# Altium schematic sheet Power.SchDoc: Flight Control Board Power Regulation System
size A; Date: Spring 2012; Author: David Greene; CompanyName: Team Sky Lights; DrawnBy: David Greene; Engineer: D'Acunto & Greene; Organization: Team Sky Lights; DocumentNumber: 1; Revision: 1.0; SheetNumber: 1; SheetTotal: 8; PageSetup: Record=PageOptions|CenterHorizontal=True|CenterVertical=True|PrintScale=1.12|XCorrection=1.00|YCorrection=1.00|PrintKind=0|BorderSize=5000000|LeftOffset=0|BottomOffset=0|Orientation=2|PaperLength=1000|PaperWidth=1000|Scale=100|PaperSource=7|PrintQuality=-4|MediaType=1|DitherType=10|PaperKind=Letter|PrintScaleMode=1; DocumentName: Flight Control Board Power Regulation System; ProjectName: The Ad-Flier!
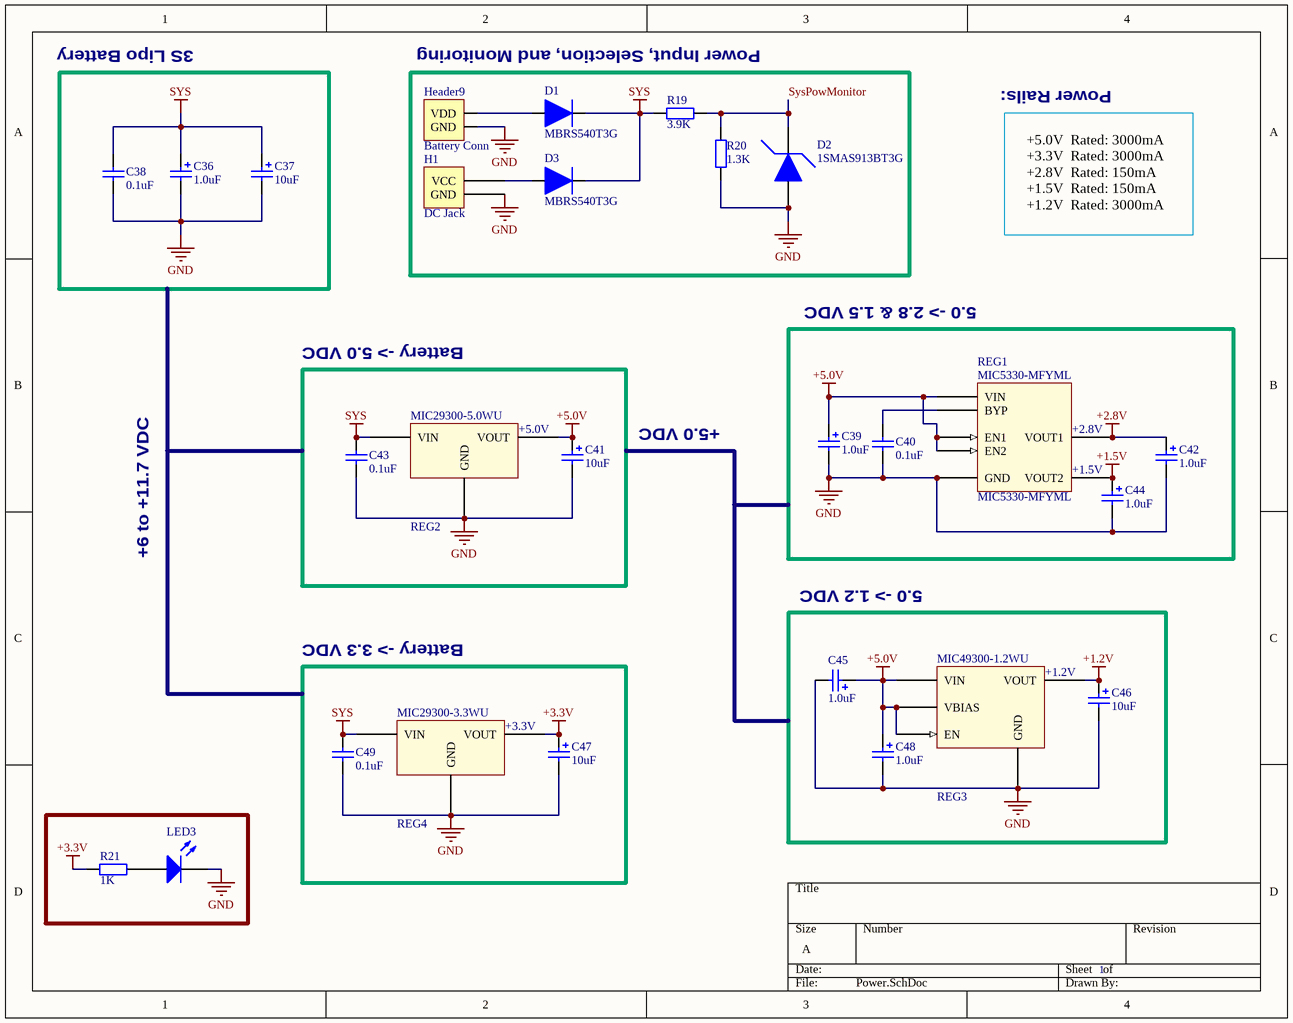
[diagram p0: Power.SchDoc]

## Parts
C36  value 1.0uF  [CAPPR2-5x5]  (hidden comment: 1.0uF Electrolitic)
C37  value 10uF  [CAPPR2-5x5]  (hidden comment: 10uF Electrolitic)
C38  value 0.1uF  [CAPRD5-6.5x4.5]  (hidden comment: 0.1uF Ceramic)
C39  value 1.0uF  [Capacitor - Tantalum Case A]  (hidden comment: 1.0uF Low-ESR Tantalum CaseA)
C40  value 0.1uF  [SMD 1206]  (hidden comment: 0.1uF SMD 1206)
C41  value 10uF  [Capacitor - Tantalum Case A]  (hidden comment: 10uF Low-ESR Tantalum CaseA)
C42  value 1.0uF  [Capacitor - Tantalum Case A]  (hidden comment: 1.0uF Low-ESR Tantalum CaseA)
C43  value 0.1uF  [SMD 1206]  (hidden comment: 0.1uF SMD 1206)
C44  value 1.0uF  [Capacitor - Tantalum Case A]  (hidden comment: 1.0uF Low-ESR Tantalum CaseA)
C45  value 1.0uF  [Capacitor - Tantalum Case A]  (hidden comment: 1.0uF Low-ESR Tantalum CaseA)
C46  value 10uF  [Capacitor - Tantalum Case A]  (hidden comment: 10uF Low-ESR Tantalum CaseA)
C47  value 10uF  [Capacitor - Tantalum Case A]  (hidden comment: 10uF Low-ESR Tantalum CaseA)
C48  value 1.0uF  [Capacitor - Tantalum Case A]  (hidden comment: 1.0uF Low-ESR Tantalum CaseA)
C49  value 0.1uF  [SMD 1206]  (hidden comment: 0.1uF SMD 1206)
D1  MBRS540T3G  [MBRS540T3G]
D2  1SMAS913BT3G  [1SMA5913BT3G]
D3  MBRS540T3G  [MBRS540T3G]
H1  DC Jack  [DC Power Jack]
Header9  Battery Conn  [PC Wire Connector]
LED3  LED PLCC-4  [PLCC-4 LED]  (value not drawn)
R19  value 3.9K  [RES12.2-8.5X3.3]  (hidden comment: 3.9K Radial)
R20  value 1.3K  [RES12.2-8.5X3.3]  (hidden comment: 1.3K Radial)
R21  value 1K  [SMD 0805]  (hidden comment: 1K SMD 0805)
REG1  MIC5330-MFYML  [MIC5330-MFYML TR]
REG2  MIC29300-5.0WU  [TO-263 D2PACK]  (value not drawn)
REG3  MIC49300-1.2WR  [MIC49300-1.2WR SPACK-5]  (value not drawn)
REG4  MIC29300-3.3WU  [TO-263 D2PACK]  (value not drawn)

## Nets
+1.2V: C46.1(+) REG3.4(VOUT)
+1.5V: C44.1(+) REG1.6(VOUT2)
+2.8V: C42.1(+) REG1.7(VOUT1)
+3.3V: C47.1(+) R21.2 REG4.2(VOUT)
+5.0V: C39.1(+) C41.1(+) C45.1(+) C48.1(+) REG1.0(VIN) REG1.3(EN2) REG1.4(EN1) REG2.2(VOUT) REG3.0(EN) REG3.1(VBIAS) REG3.3(VIN)
GND: C36.2 C37.2 C38.1 C39.2(-) C40.1 C41.2(-) C42.2(-) C43.2 C44.2(-) C45.2(-) C46.2(-) C47.2(-) C48.2(-) C49.1 D2.0(In) H1.GND Header9.R(GND) LED3.2(K) R20.1 REG1.1(GND) REG2.1(GND) REG3.2(GND) REG4.1(GND)
SYS: C36.1 C37.1 C38.2 C43.1 C49.2 D1.1(Out) D3.1(Out) R19.2 REG2.0(VIN) REG4.0(VIN)
SysPowMonitor: D2.1(Out) R19.1 R20.2
NetC40_2: C40.2 REG1.2(BYP)
NetD1_0: D1.0(In) Header9.L(VDD)
NetD3_0: D3.0(In) H1.VCC
NetLED3_1: LED3.1(A) R21.1

Not connected (* = marked no-connect by the designer): H1 NC; REG1 5(NC)

## Notes on the sheet
- 3S Lipo Battery
- Power Input, Selection, and Monitoring
- Power Rails:
- +5.0V  Rated: 3000mA
  +3.3V  Rated: 3000mA
  +2.8V  Rated: 150mA
  +1.5V  Rated: 150mA
  +1.2V  Rated: 3000mA
- 5.0 -> 2.8 & 1.5 VDC
- Battery -> 5.0 VDC
- +5.0 VDC
- +6 to +11.7 VDC
- Battery -> 3.3 VDC
- 5.0 -> 1.2 VDC
- 1
- (in symbol MIC5330-MFYML) +2.8V; +1.5V
- (in symbol MIC29300-3.3WU) +3.3V
- (in symbol MIC29300-5.0WU) +5.0V
- (in symbol MIC49300-1.2WR) MIC49300-1.2WU; +1.2V

## Library data of the parts
C36 C37 = Cap Pol1: Polarized Capacitor (Radial); Published: 8-Jun-2000; LatestRevisionDate: 17-Jul-2002; LatestRevisionNote: Re-released for DXP Platform.; PackageReference: RB7.6-15; Publisher: Altium Limited; PackageDescription: Polarized Capacitor (Radial); 2 Leads
C38 C40 C43 C49 = Cap: Capacitor
C39 C41 C42 C44-C48 = SMD_Cap_Tantalum: Tantalum Capacitor - Case A
D1 D3 = MBRS540T3G: 40V 5A Scottky Diode; pin to pad: 0>A 1>K
D2 = 1SMAS913BT3G: 3.3V 1.5W Zener Diode; pin to pad: 0>A 1>K
H1 = DC Jack: DC Power Jack; pin to pad: GND>OUT VCC>IN
Header9 = PC Wire Connector
LED3 = SMD LED: Surface Mount Chip LED; pin to pad: 1>2 2>1
R19-R21 = Res2: Resistor
REG1 = MIC5330-MFYML: Dual 300mA LDO (Lead Free Compliant); pin to pad: 0>1 1>2 2>3 3>4 4>5 5>6 6>7 7>8
REG2 = MIC29300-5.0WU: 3.0A LDO Fixed Volt.(ROHS Compliant); pin to pad: 0>1 1>2 2>3
REG3 = MIC49300-1.2WR: Dual Supply, LV 3.0A LDO(ROHS Compliant); pin to pad: 0>1 1>2 2>3 3>4 4>5
REG4 = MIC29300-3.3WU: 3.0A LDO Fixed Volt.(ROHS Compliant); pin to pad: 0>1 1>2 2>3